# EAGLE schematic minimoog-filter (EAGLE 9.6.2)
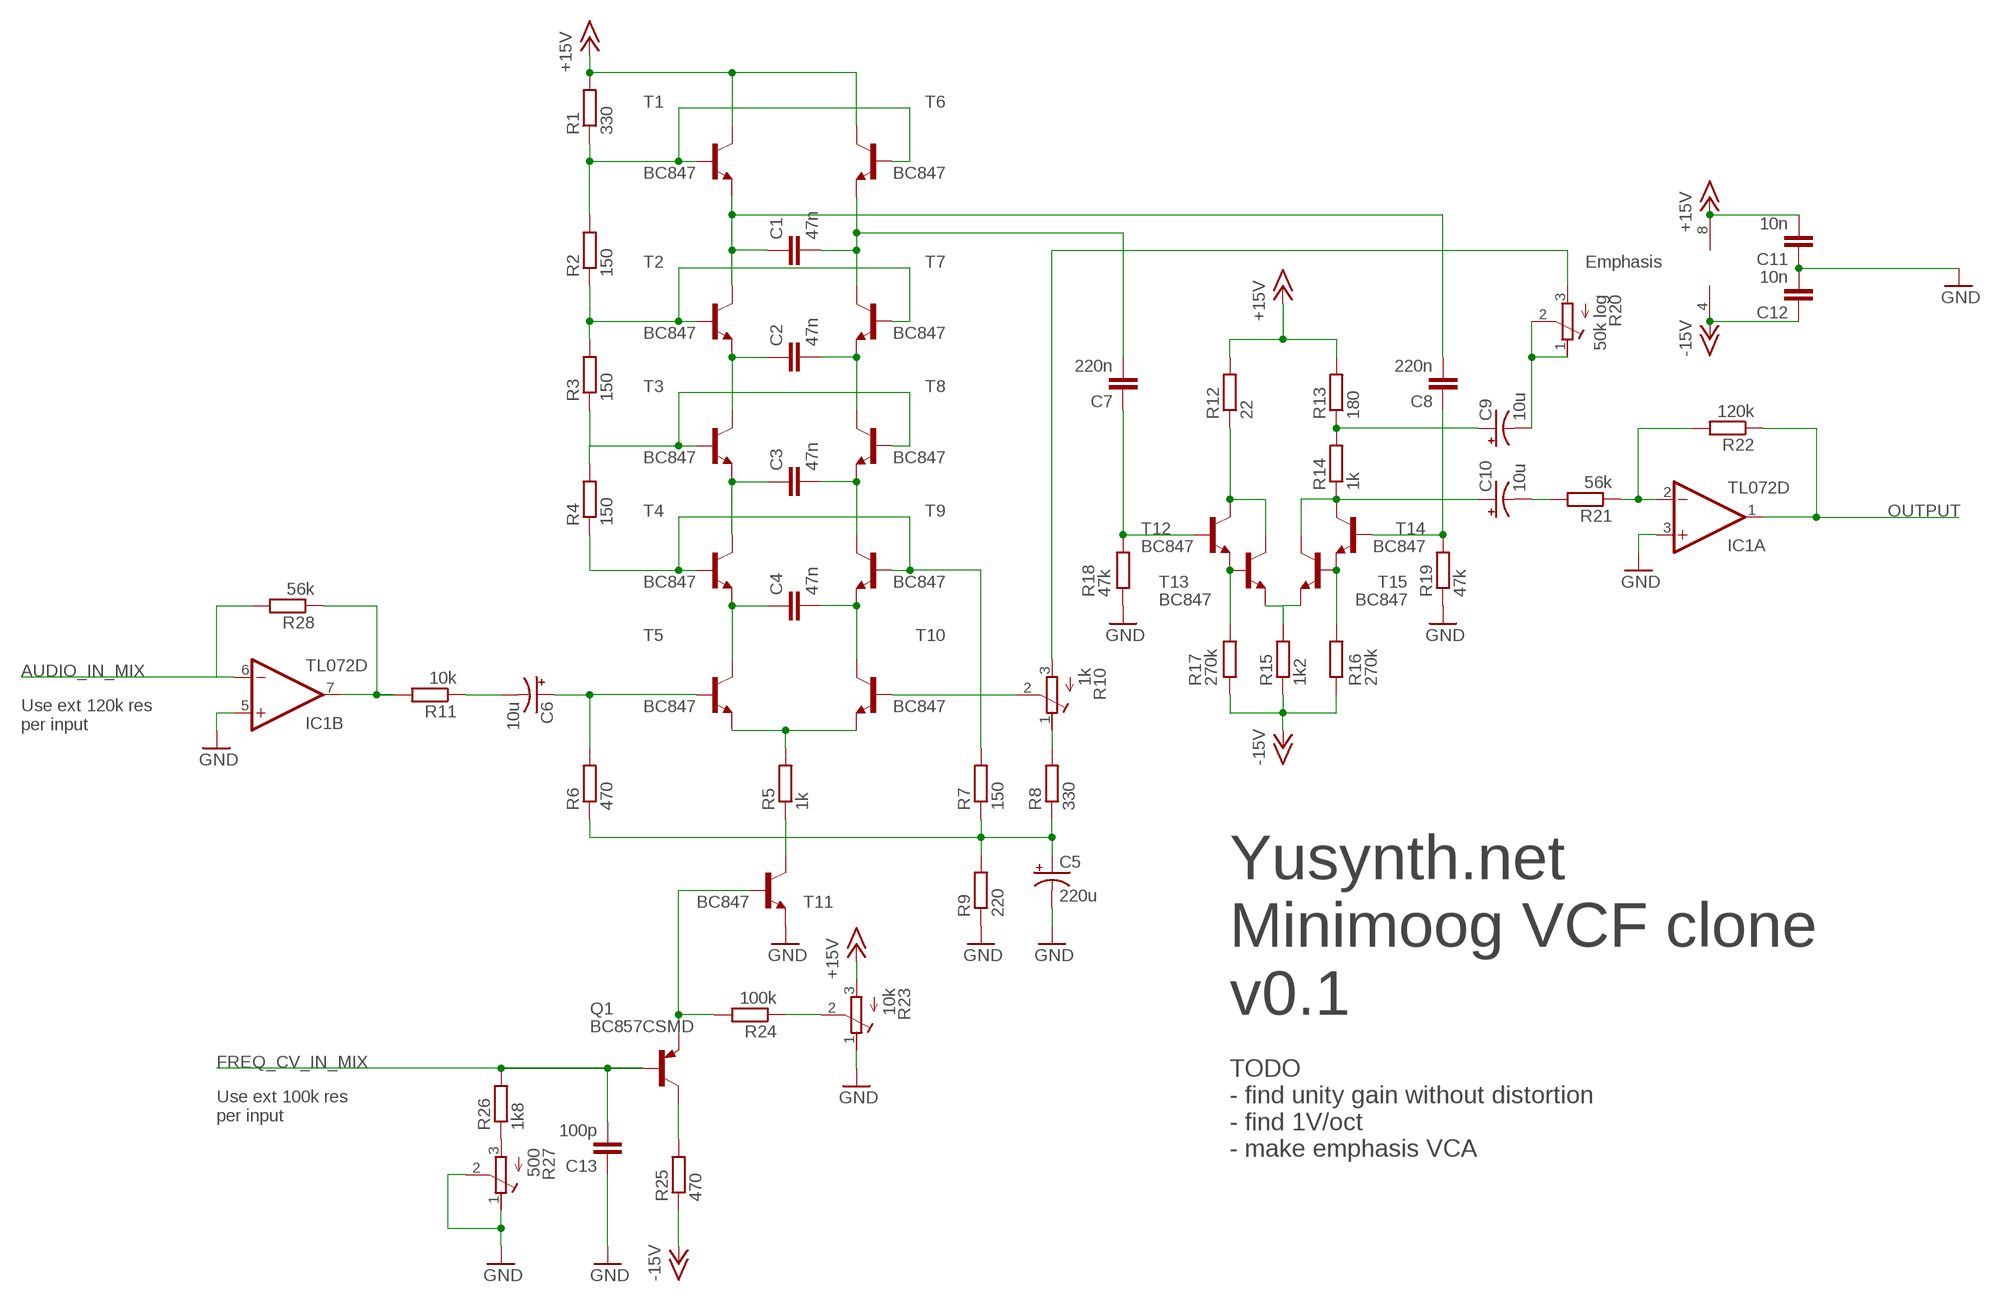
[diagram p0: schematic, sheet 1]

## Parts
C1  47n  C-EUC0805  [C0805]
C2  47n  C-EUC0805  [C0805]
C3  47n  C-EUC0805  [C0805]
C4  47n  C-EUC0805  [C0805]
C5  220u  CPOL-USE2-5  [E2-5]
C6  10u  CPOL-USE2-5  [E2-5]
C7  220n  C-EUC0805  [C0805]
C8  220n  C-EUC0805  [C0805]
C9  10u  CPOL-USE2-5  [E2-5]
C10  10u  CPOL-USE2-5  [E2-5]
C11  10n  C-EUC0805  [C0805]
C12  10n  C-EUC0805  [C0805]
C13  100p  C-EUC0805  [C0805]
IC1  TL072D  [SO08]
Q1  BC857CSMD  [SOT23-BEC]
R1  330  R-EU_R0805  [R0805]
R2  150  R-EU_R0805  [R0805]
R3  150  R-EU_R0805  [R0805]
R4  150  R-EU_R0805  [R0805]
R5  1k  R-EU_R0805  [R0805]
R6  470  R-EU_R0805  [R0805]
R7  150  R-EU_R0805  [R0805]
R8  330  R-EU_R0805  [R0805]
R9  220  R-EU_R0805  [R0805]
R10  1k  R-TRIMMT93YA  [RTRIMT93YA]
R11  10k  R-EU_R0805  [R0805]
R12  22  R-EU_R0805  [R0805]
R13  180  R-EU_R0805  [R0805]
R14  1k  R-EU_R0805  [R0805]
R15  1k2  R-EU_R0805  [R0805]
R16  270k  R-EU_R0805  [R0805]
R17  270k  R-EU_R0805  [R0805]
R18  47k  R-EU_R0805  [R0805]
R19  47k  R-EU_R0805  [R0805]
R20  50k log  R-TRIMMT93YA  [RTRIMT93YA]
R21  56k  R-EU_R0805  [R0805]
R22  120k  R-EU_R0805  [R0805]
R23  10k  R-TRIMMT93YA  [RTRIMT93YA]
R24  100k  R-EU_R0805  [R0805]
R25  470  R-EU_R0805  [R0805]
R26  1k8  R-EU_R0805  [R0805]
R27  500  R-TRIMMT93YA  [RTRIMT93YA]
R28  56k  R-EU_R0805  [R0805]
T1  BC847  [SOT23]
T2  BC847  [SOT23]
T3  BC847  [SOT23]
T4  BC847  [SOT23]
T5  BC847  [SOT23]
T6  BC847  [SOT23]
T7  BC847  [SOT23]
T8  BC847  [SOT23]
T9  BC847  [SOT23]
T10  BC847  [SOT23]
T11  BC847  [SOT23]
T12  BC847  [SOT23]
T13  BC847  [SOT23]
T14  BC847  [SOT23]
T15  BC847  [SOT23]

## Nets
+15V: C11.2 IC1.8(P:V+) R1.2 R12.2 R13.2 R23.3(E) T1.3(C) T6.3(C)
-15V: C12.1 IC1.4(P:V-) R15.1 R16.1 R17.1 R25.1
AUDIO_IN_MIX: IC1.6(B:-IN) R28.2
FREQ_CV_IN_MIX: C13.2 Q1.B R26.2
GND: C5.- C11.1 C12.2 C13.1 IC1.3(A:+IN) IC1.5(B:+IN) R9.1 R18.1 R19.1 R23.1(A) R27.1(A) R27.2(S) T11.2(E)
N$1: C1.1 C8.2 T1.2(E) T2.3(C)
N$2: C1.2 C7.2 T6.2(E) T7.3(C)
N$3: C2.1 T2.2(E) T3.3(C)
N$4: C2.2 T7.2(E) T8.3(C)
N$5: C3.1 T3.2(E) T4.3(C)
N$6: C3.2 T8.2(E) T9.3(C)
N$7: C4.1 T4.2(E) T5.3(C)
N$8: C4.2 T9.2(E) T10.3(C)
N$9: R5.2 T5.2(E) T10.2(E)
N$10: R2.1 R3.2 T2.1(B) T7.1(B)
N$11: R1.1 R2.2 T1.1(B) T6.1(B)
N$12: R3.1 R4.2 T3.1(B) T8.1(B)
N$13: R4.1 R7.2 T4.1(B) T9.1(B)
N$14: R10.2(S) T10.1(B)
N$15: C7.1 R18.2 T12.1(B)
N$16: R5.1 T11.3(C)
N$17: C5.+ R6.1 R7.1 R8.1 R9.2
N$18: C9.+ R13.1 R14.2
N$19: R8.2 R10.1(A)
N$20: C6.+ R6.2 T5.1(B)
N$21: C6.- R11.1
N$22: C10.+ R14.1 T14.3(C) T15.3(C)
N$23: R16.2 T14.2(E) T15.1(B)
N$24: R17.2 T12.2(E) T13.1(B)
N$25: R12.1 T12.3(C) T13.3(C)
N$26: R15.2 T13.2(E) T15.2(E)
N$27: C8.1 R19.2 T14.1(B)
N$28: R10.3(E) R20.3(E)
N$29: C9.- R20.1(A) R20.2(S)
N$30: C10.- R21.2
N$31: IC1.2(A:-IN) R21.1 R22.2
N$32: R23.2(S) R24.1
N$33: Q1.E R24.2 T11.1(B)
N$34: Q1.C R25.2
N$35: R26.1 R27.3(E)
N$39: IC1.7(B:OUT) R11.2 R28.1
OUTPUT: IC1.1(A:OUT) R22.1

## Notes on the sheet
- Emphasis
- Use ext 120k res
  per input
- Yusynth.net
  Minimoog VCF clone
  v0.1
- Use ext 100k res
  per input
- TODO
  - find unity gain without distortion
  - find 1V/oct
  - make emphasis VCA

## Library data of the parts
C1-C4 C7 C8 C11-C13 = resistor:C-EU: CAPACITOR, European symbol
C5 C6 C9 C10 = resistor:CPOL-US: POLARIZED CAPACITOR, American symbol
IC1 = linear:TL072: OP AMP
Q1 = transistor-pnp:BC857*: PNP Transistror
R1-R9 R11-R19 R21 R22 R24-R26 R28 = resistor:R-EU_: RESISTOR, European symbol
R10 R20 R23 R27 = resistor:R-TRIMM: Trimm resistor
T1-T15 = transistor:BC847: NPN TRANSISTOR